# EAGLE design LEDSlave (EAGLE 7.6.0)
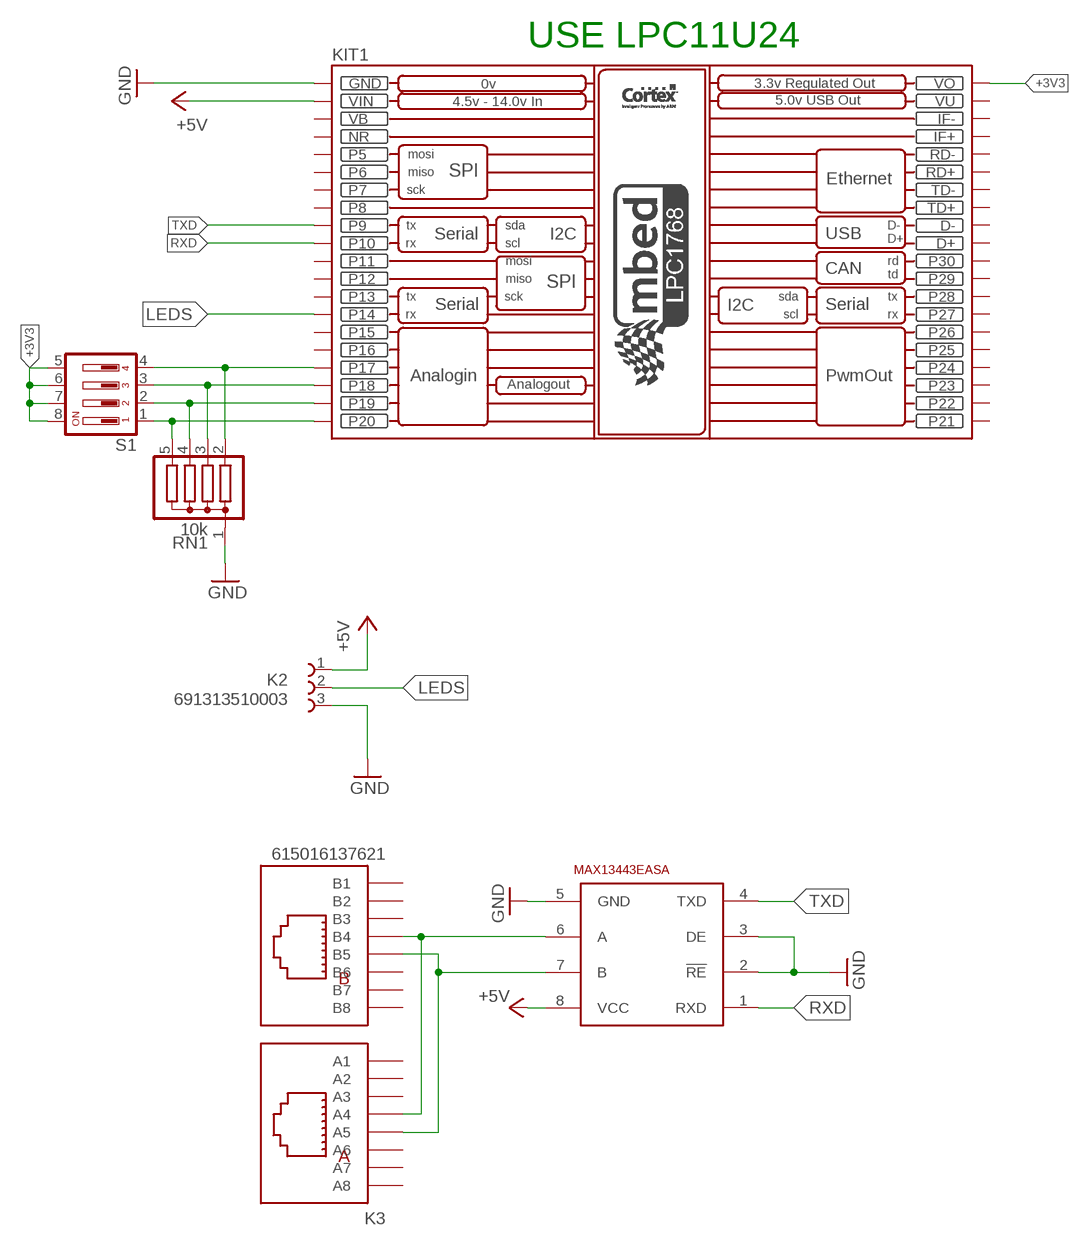
[diagram p0: schematic, sheet 1]

## Parts
K2  691313510003  [691313510003]
K3  615016137621  [615016137621]
KIT1  MBED_NXP_LPC1768  [MBED-KIT]
RN1  10k  G04R  [SIL5]
S1  DA04  [DA-04]
U$1  MAX13443EASA  [SO08]

## Nets
+3V3: KIT1.VOUT(VO) S1.5 S1.6 S1.7 S1.8
+5V: K2.1 KIT1.VIN U$1.8(VCC)
GND: K2.3 KIT1.GND RN1.1 U$1.2(!RE) U$1.3(DE) U$1.5(GND)
LEDS: K2.2 KIT1.P$14(P14)
N$1: KIT1.P$20(P20) RN1.5 S1.1
N$2: KIT1.P$19(P19) RN1.4 S1.2
N$3: KIT1.P$18(P18) RN1.3 S1.3
N$4: KIT1.P$17(P17) RN1.2 S1.4
N$5: K3.A4 K3.B4 U$1.6(A)
N$6: K3.A5 K3.B5 U$1.7(B)
RXD: KIT1.P$10(P10) U$1.1(RXD)
TXD: KIT1.P$9(P9) U$1.4(TXD)
Unconnected: K3.A1 K3.A2 K3.A3 K3.A6 K3.A7 K3.A8 K3.B1 K3.B2 K3.B3 K3.B6 K3.B7 K3.B8 KIT1.D+ KIT1.D- KIT1.IF+ KIT1.IF- KIT1.P$5(P5) KIT1.P$6(P6) KIT1.P$7(P7) KIT1.P$8(P8) KIT1.P$11(P11) KIT1.P$12(P12) KIT1.P$13(P13) KIT1.P$15(P15) KIT1.P$16(P16) KIT1.P$21(P21) KIT1.P$22(P22) KIT1.P$23(P23) KIT1.P$24(P24) KIT1.P$25(P25) KIT1.P$26(P26) KIT1.P$27(P27) KIT1.P$28(P28) KIT1.P$29(P29) KIT1.P$30(P30) KIT1.RD+ KIT1.RD- KIT1.TD+ KIT1.TD-

## Notes on the sheet
- USE LPC11U24

## Power pins joined to a net without a drawn wire
NR: KIT1.NR
VB: KIT1.VB
VU: KIT1.VU

## Library data of the parts
K2 = Terminal_Blocks_Connectors_rev15e:691313510003: WR-TBL Serie 313 - 5.08 mm Close Horizontal PCB Header , 3 Pins=>Code : Con_TBL_Pluggable_5.08_PCB_THT_Simple_H_691313510003 <http://katalog.we-online.de/media/images/eican/Con_TBL_Pluggable_5.08_PCB_THT_Simple_H_6913135100xx_pf2.jpg> Details see: http://katalog.we-online.de/en/em/691_313_510_0xx Created 2014-06-25, Karrer Zheng 2014 (C) Würth Elektronik
K3 = Input-Output_Connectors_rev15d:615016137621: WR-MJ Horizontal Shielded Dual Port 8P8C Modular Jack Tab Down, 16 Pins=>Code : Con_I-O_MJ-H_Shielded_Down_615016137621 <http://katalog.we-online.de/media/images/eican/Con_I-O_MJ-H_Shielded_Down_615016137621_pf2.jpg> Details see: http://katalog.we-online.de/en/em/615_016_137_621 Created 2014-07-10, Karrer Zheng 2014 (C) Würth Elektronik
KIT1 = MBED_v2.1:MBED_NXP_LPC1768: Mbed LPC1768 - ARM CORTEX v2.1 * Schematic symbol is now placed in eagles's default raster. *The pads diameter are suitable for routing between mbed pins * mbed pads are 0.8 mm drill diameter. --------------------------------------------- Created by: Mohamed Yousry *Alexandria, Egypt *Email: mohamed.yousry@ieeegoldegypt.org
RN1 = resistor-sil:G04R: SIL RESISTOR; OC_FARNELL: unknown; OC_NEWARK: unknown
S1 = switch-dil:DA04: DIL/CODE SWITCH; MPN: MCDA04; OC_FARNELL: 9471545; OC_NEWARK: 26M1090
U$1 = MAX13443EASA:MAX13443EASA

## Board
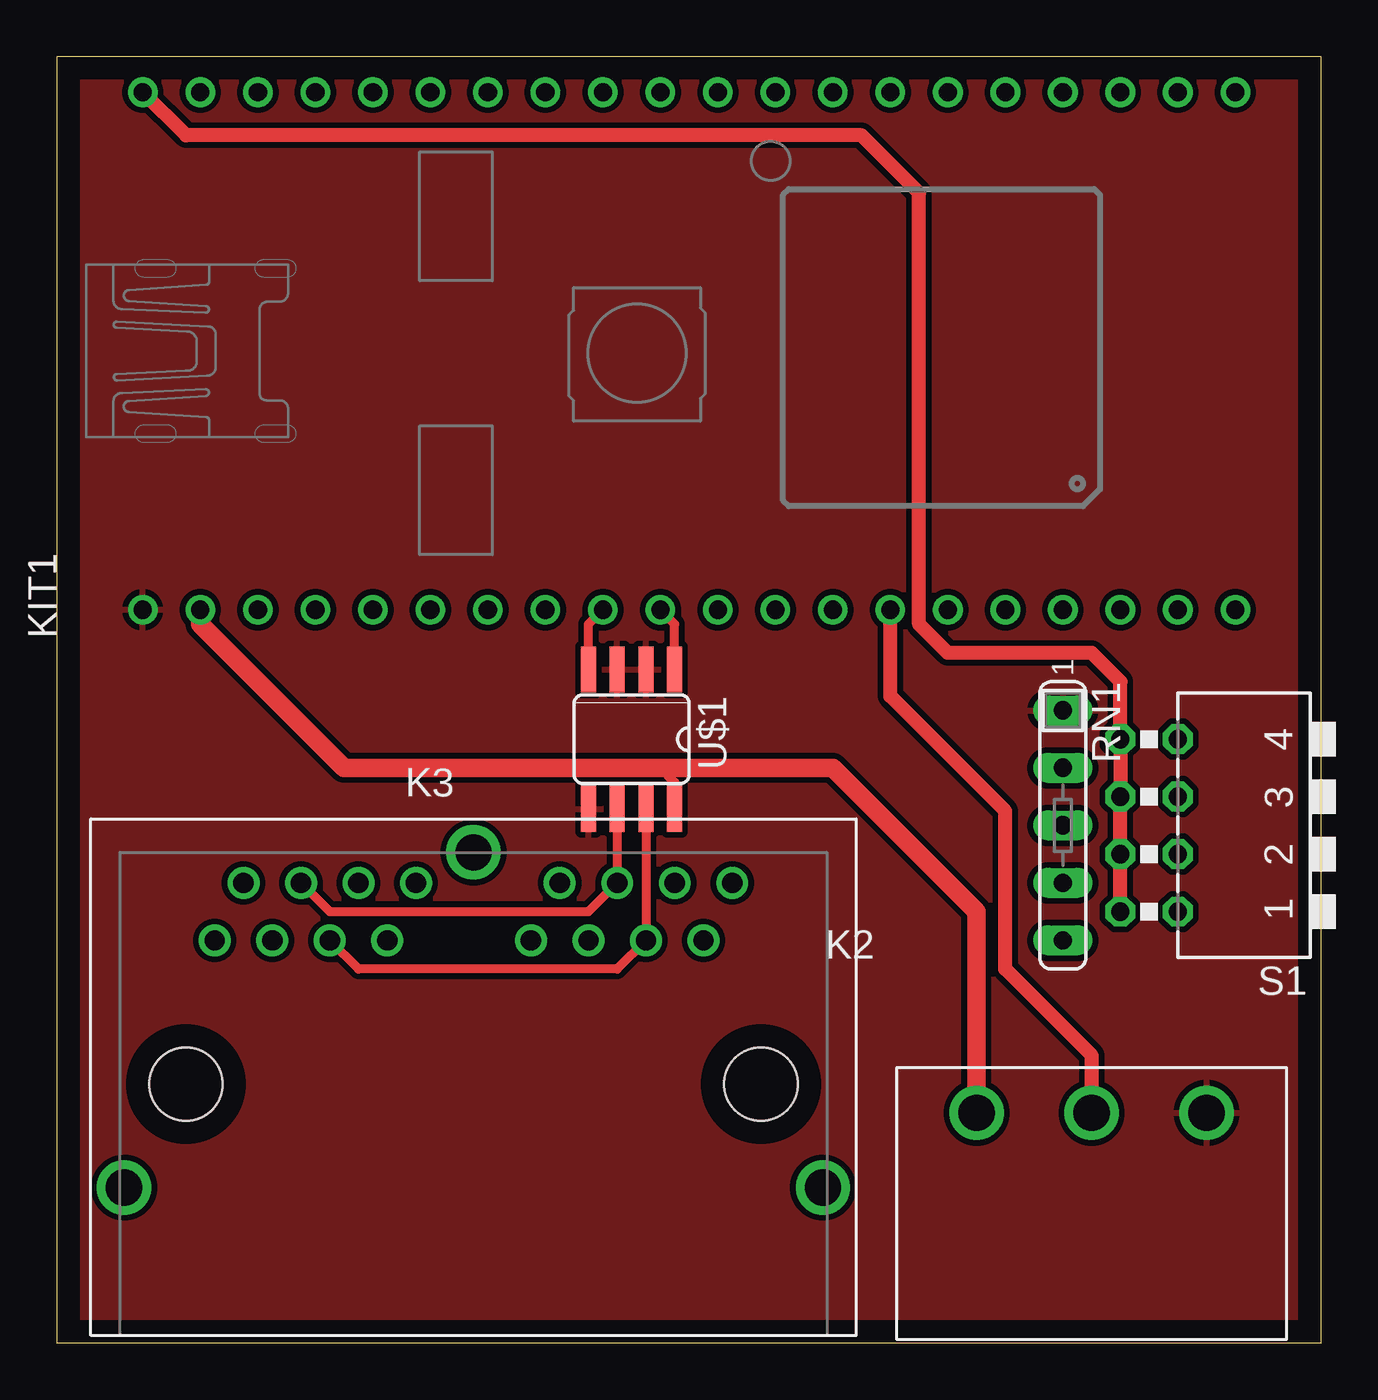
[diagram p1: board, top side]
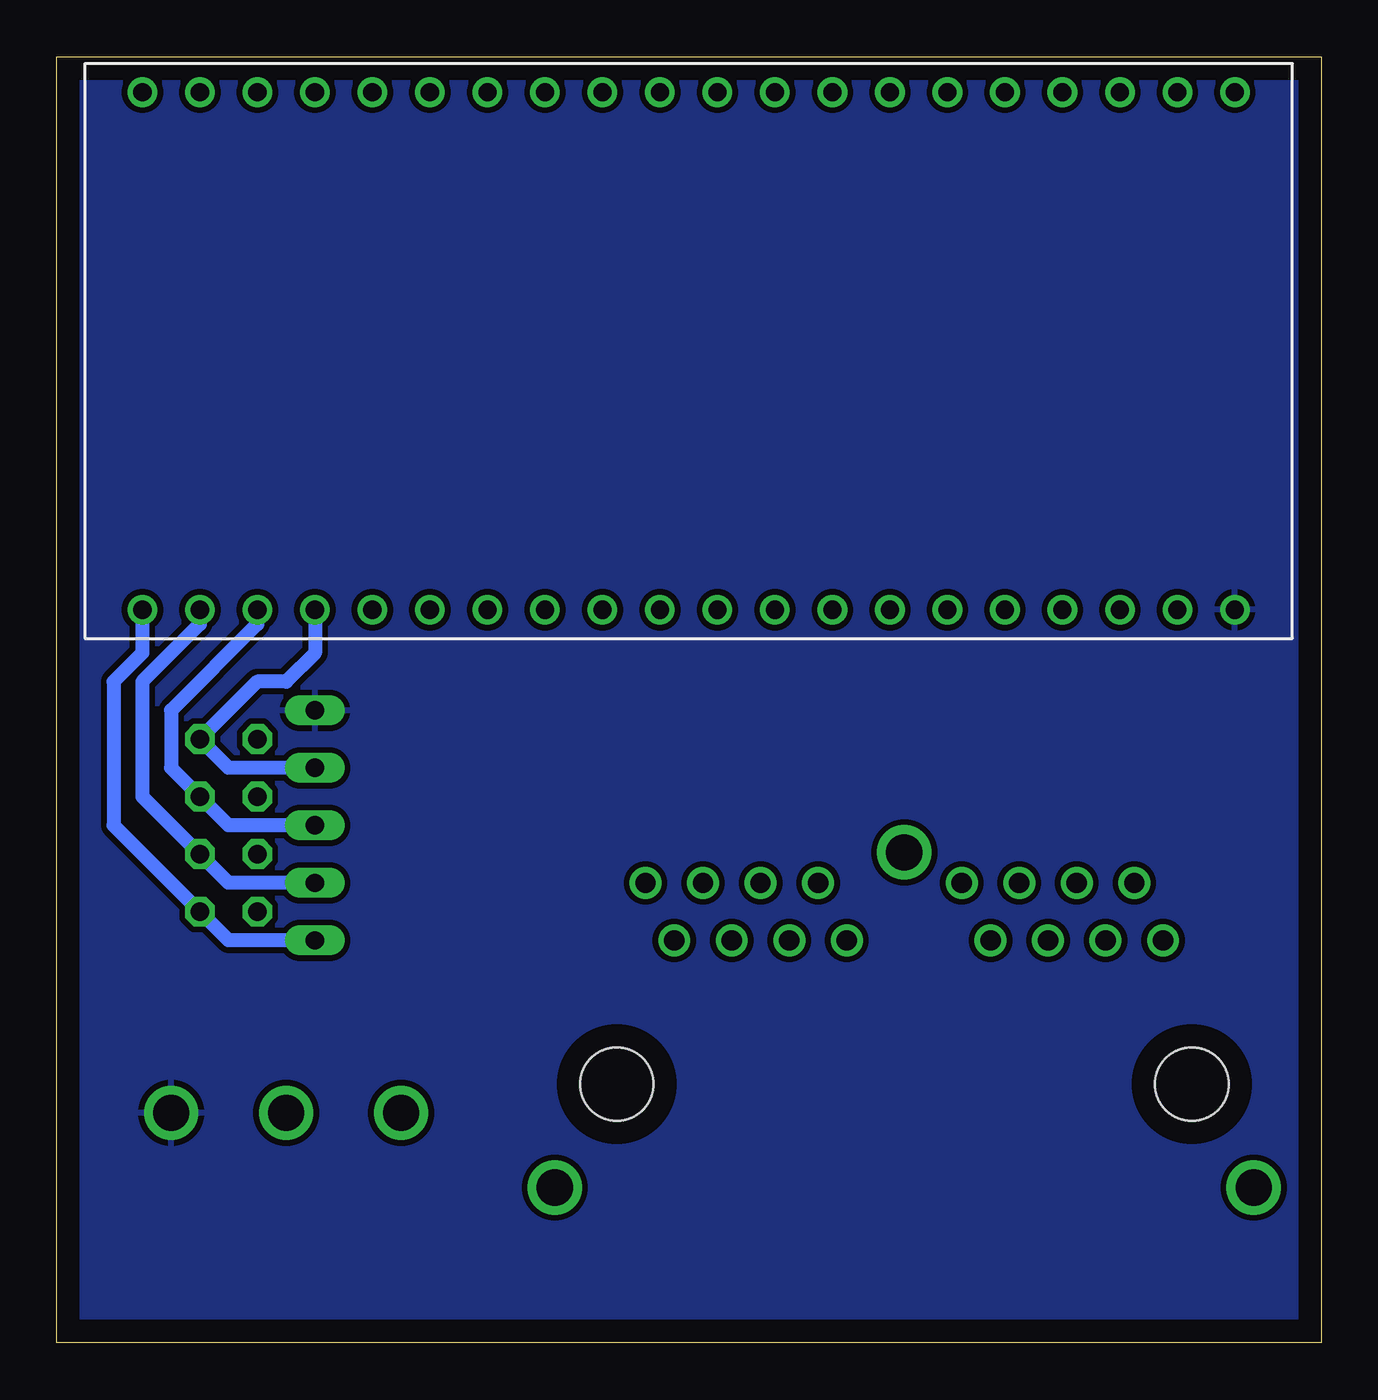
[diagram p2: board, bottom side, seen from below]

Size 55.86 x 56.82 mm. Coordinates in mm from the lower left corner, seen from the top.
Outline: 0,0 55.86,0 55.86,56.82 0,56.82 0,0
Copper layers (1*16): Top 0.035mm / dielectric 1.5mm / Bottom 0.035mm
Design rules "default": minimum track width 10mil, minimum drill 24mil, track to track 8mil, track to pad 8mil, pad to pad 8mil, via to via 8mil, smd to smd 8mil, copper to edge 40mil, drill to drill 8mil, minimum pad ring 10mil, minimum via ring 8mil, stop-mask expansion 4mil, vias tented up to drill 0mil, thermal gap 10mil

### Footprints (pad centres in the part's own frame; a part is rotated, then mirrored left to right if it is on the bottom)
691313510003 = drill 1.6: 1 -5.08,0; 2 0,0; 3 5.08,0
615016137621 = drill 0.9: A1 -11.43,-1.27; A2 -10.16,1.27; A3 -8.89,-1.27; A4 -7.62,1.27; A5 -6.35,-1.27; A6 -5.08,1.27; A7 -3.81,-1.27; A8 -2.54,1.27; B1 2.54,-1.27; B2 3.81,1.27; B3 5.08,-1.27; B4 6.35,1.27; B5 7.62,-1.27; B6 8.89,1.27; B7 10.16,-1.27; B8 11.43,1.27 | drill 1.6: Z1 -15.435,-12.19; Z2 15.435,-12.19; Z3 0,2.62 | hole 3.25: -12.7,-7.62; 12.7,-7.62
MBED-KIT = drill 0.8: D+ 11.43,1.27; D- 11.43,3.81; GND -11.43,24.13; IF+ 11.43,16.51; IF- 11.43,19.05; NR -11.43,16.51; P$5 -11.43,13.97; P$6 -11.43,11.43; P$7 -11.43,8.89; P$8 -11.43,6.35; P$9 -11.43,3.81; P$10 -11.43,1.27; P$11 -11.43,-1.27; P$12 -11.43,-3.81; P$13 -11.43,-6.35; P$14 -11.43,-8.89; P$15 -11.43,-11.43; P$16 -11.43,-13.97; P$17 -11.43,-16.51; P$18 -11.43,-19.05; P$19 -11.43,-21.59; P$20 -11.43,-24.13; P$21 11.43,-24.13; P$22 11.43,-21.59; P$23 11.43,-19.05; P$24 11.43,-16.51; P$25 11.43,-13.97; P$26 11.43,-11.43; P$27 11.43,-8.89; P$28 11.43,-6.35; P$29 11.43,-3.81; P$30 11.43,-1.27; RD+ 11.43,11.43; RD- 11.43,13.97; TD+ 11.43,6.35; TD- 11.43,8.89; VB -11.43,19.05; VIN -11.43,21.59; VOUT 11.43,24.13; VU 11.43,21.59
SIL5 = drill 0.813 long: 1 -5.08,0; 2 -2.54,0; 3 0,0; 4 2.54,0; 5 5.08,0
DA-04 = drill 0.813 octagon: 1 -3.81,-1.27; 2 -1.27,-1.27; 3 1.27,-1.27; 4 3.81,-1.27; 5 3.81,1.27; 6 1.27,1.27; 7 -1.27,1.27; 8 -3.81,1.27
SO08 = smd 0.66 x 2.032: 1 -1.905,-3.073; 2 -0.635,-3.073; 3 0.635,-3.073; 4 1.905,-3.073; 5 1.905,3.073; 6 0.635,3.073; 7 -0.635,3.073; 8 -1.905,3.073

### Placement (x,y rotation side)
K2  45.72,10.16 0 top
K3  18.41,19.05 0 top
KIT1  27.94,43.81 90 top
RN1  44.45,22.86 270 top
S1  48.26,22.86 90 top
U$1  25.4,26.67 180 top

### Tracks (layer width: path | path; a pad name or v marks a point on that pad's centre or on a via)
+3V3
  Top 0.61: S1.8 S1.7 S1.6 S1.5 46.99,29.21 45.72,30.48 39.37,30.48 38.1,31.75 38.1,50.8 35.56,53.34 5.71,53.34 KIT1.VOUT
+5V
  Top 0.406: U$1.8 27.3,24.77 26.67,25.4
  Top 0.813: K2.1 40.64,19.05 34.29,25.4 26.67,25.4 12.7,25.4 6.35,31.75 KIT1.VIN
GND
  pour Bottom (isolate 0.254): -2.54,58.42 57.15,58.42 57.15,-1.27 -2.54,-1.27
  pour Top (isolate 0.254): -1.27,58.42 58.42,58.42 58.42,-2.54 -1.27,-2.54
LEDS
  Top 0.61: K2.2 45.72,12.7 41.91,16.51 41.91,23.5 36.83,28.57 KIT1.P$14
N$1
  Bottom 0.61: RN1.5 48.26,17.78 S1.1 53.34,22.86 53.34,29.21 52.07,30.48 KIT1.P$20
N$2
  Bottom 0.61: RN1.4 48.26,20.32 S1.2 52.07,24.13 52.07,29.21 49.53,31.75 KIT1.P$19
N$3
  Bottom 0.61: RN1.3 48.26,22.86 S1.3 50.8,25.4 50.8,27.94 46.99,31.75 KIT1.P$18
N$4
  Bottom 0.61: RN1.2 48.26,25.4 S1.4 46.99,29.21 45.72,29.21 44.45,30.48 KIT1.P$17
N$5
  Top 0.406: U$1.6 K3.B4 23.5,19.05 12.06,19.05 K3.A4
N$6
  Top 0.406: U$1.7 K3.B5 24.77,16.51 13.34,16.51 K3.A5
RXD
  Top 0.406: U$1.1 27.3,31.75 KIT1.P$10
TXD
  Top 0.406: U$1.4 23.5,31.75 KIT1.P$9